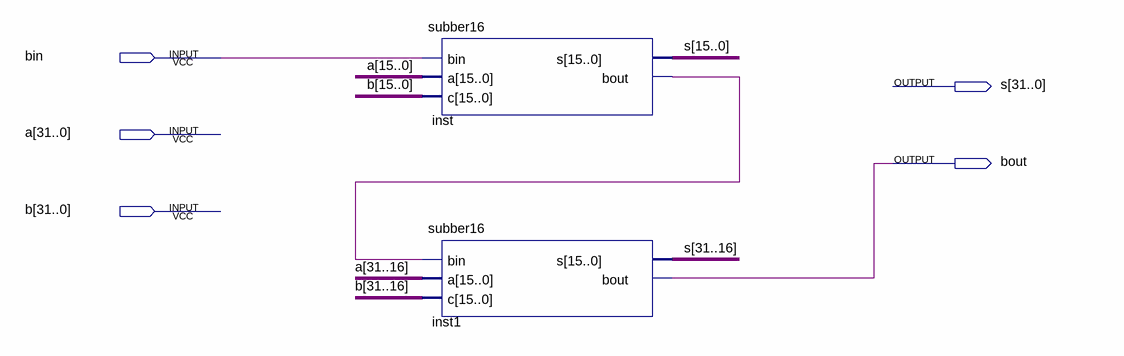
[diagram p0: schematic sheet]
// Quartus schematic subber32.bdf as structural Verilog: 2 symbols, 5 pins
module subber32 (
  input  bin,
  input  [31:0] a,
  input  [31:0] b,
  output [31:0] s,
  output bout
);

  wire inst_bout;

  subber16 inst (.bin(bin), .a(a[15:0]), .c(b[15:0]), .s(s[15:0]), .bout(inst_bout));
  subber16 inst1 (.bin(inst_bout), .a(a[31:16]), .c(b[31:16]), .s(s[31:16]), .bout(bout));
endmodule
